# EAGLE design DIY Arduino - REV 1 (EAGLE 9.4.0)
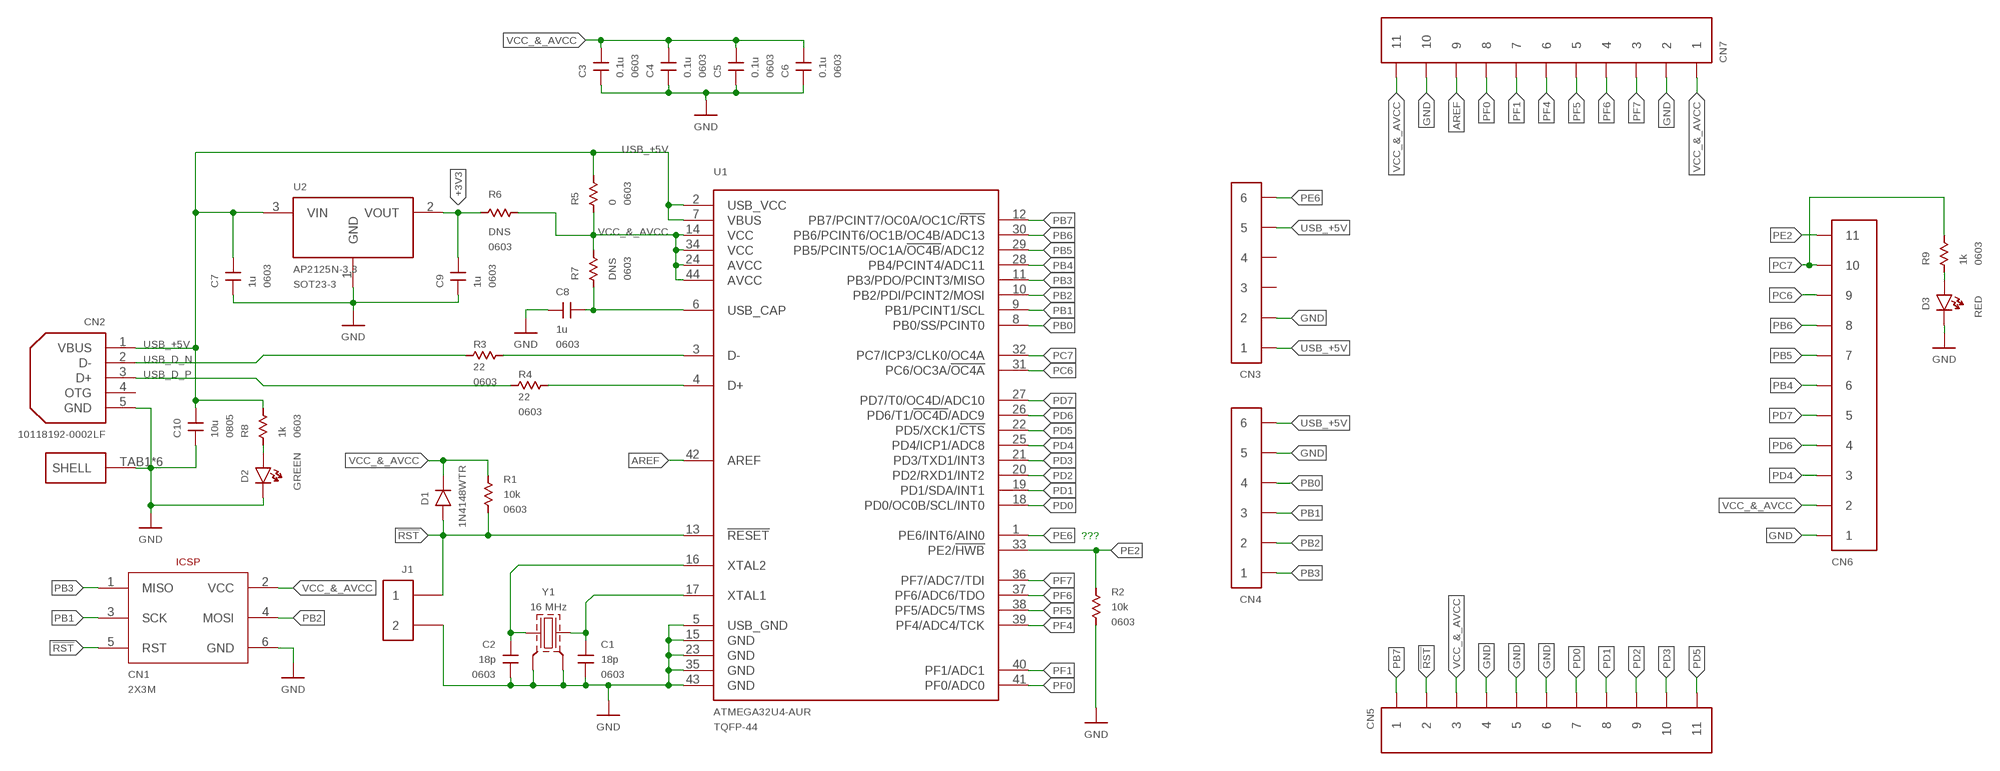
[diagram p0: schematic, sheet 1]

## Parts
C1  18p  C_SMDC0603  [EIA0603]
C2  18p  C_SMDC0603  [EIA0603]
C3  0.1u  C_SMDC0603  [EIA0603]
C4  0.1u  C_SMDC0603  [EIA0603]
C5  0.1u  C_SMDC0603  [EIA0603]
C6  0.1u  C_SMDC0603  [EIA0603]
C7  1u  C_SMDC0603  [EIA0603]
C8  1u  C_SMDC0603  [EIA0603]
C9  1u  C_SMDC0603  [EIA0603]
C10  10u  C_SMDC0805  [EIA0805]
CN1  2X3M  2X3_ICSPARDUINO_ICSP  [2X3_100MIL_ICSP]
CN2  10118192-0002LF  USB_MICRO_B_GENERICSMT  [AMPHENOL_10118192-0002LF]
CN3  1X6THRU  [1X6_100MIL_THRU]
CN4  1X6THRU  [1X6_100MIL_THRU]
CN5  1X11  [1X11_100MIL_THRU]
CN6  1X11  [1X11_100MIL_THRU]
CN7  1X11  [1X11_100MIL_THRU]
D1  1N4148WTR  SILICON  [SOD-123]
D2  GREEN  LED_SMD  [EIA0603_LED]
D3  RED  LED_SMD  [EIA0603_LED]
J1  1X2  [1X2_100MIL_THRU]
R1  10k  R_SMDR0603  [EIA0603]
R2  10k  R_SMDR0603  [EIA0603]
R3  22  R_SMDR0603  [EIA0603]
R4  22  R_SMDR0603  [EIA0603]
R5  0  R_SMDR0603  [EIA0603]
R6  DNS  R_SMDR0603  [EIA0603]
R7  DNS  R_SMDR0603  [EIA0603]
R8  1k  R_SMDR0603  [EIA0603]
R9  1k  R_SMDR0603  [EIA0603]
U1  ATMEGA32U4-AUR  ATMEGA32U4TQFP-44  [TQFP-44]
U2  AP2125N-3.3  AP2125FIXED  [SOT23-3]
Y1  16 MHz  CRYSTALFA-238  [EPSON_FA-238]

## Nets
!RST: CN1.5(RST) CN5.2 D1.A J1.1 R1.P$1 U1.13(!RESET)
+3V3: C9.P$2 R6.P$1 U2.2(VOUT)
AREF: CN7.9 U1.42(AREF)
D_N [USB_DIFF]: R3.P$2 U1.3(D-)
D_P [USB_DIFF]: R4.P$2 U1.4(D+)
GND: C1.P$1 C2.P$1 C3.P$1 C4.P$1 C5.P$1 C6.P$1 C7.P$1 C8.P$1 C9.P$1 C10.P$1 CN1.6(GND) CN2.5(GND) CN2.TAB1(SHELL) CN2.TAB2(SHELL) CN2.TAB3(SHELL) CN2.TAB4(SHELL) CN2.TAB5(SHELL) CN2.TAB6(SHELL) CN3.2 CN4.5 CN5.4 CN5.5 CN5.6 CN6.1 CN7.2 CN7.10 D2.C D3.C J1.2 R2.P$1 U1.5(USB_GND) U1.15(GND) U1.23(GND) U1.35(GND) U1.43(GND) U2.1(GND) Y1.2(GND) Y1.4(GND)
N$1: C2.P$2 U1.16(XTAL2) Y1.1
N$2: D3.A R9.P$1
N$3: C8.P$2 R7.P$1 U1.6(USB_CAP)
N$4: C1.P$2 U1.17(XTAL1) Y1.3
N$7: D2.A R8.P$1
PB0: CN4.4 U1.8(PB0/SS/PCINT0)
PB1: CN1.3(SCK) CN4.3 U1.9(PB1/PCINT1/SCL)
PB2: CN1.4(MOSI) CN4.2 U1.10(PB2/PDI/PCINT2/MOSI)
PB3: CN1.1(MISO) CN4.1 U1.11(PB3/PDO/PCINT3/MISO)
PB4: CN6.6 U1.28(PB4/PCINT4/ADC11)
PB5: CN6.7 U1.29(PB5/PCINT5/OC1A/!OC4B!/ADC12)
PB6: CN6.8 U1.30(PB6/PCINT6/OC1B/OC4B/ADC13)
PB7: CN5.1 U1.12(PB7/PCINT7/OC0A/OC1C/!RTS)
PC6: CN6.9 U1.31(PC6/OC3A/!OC4A)
PC7: CN6.10 R9.P$2 U1.32(PC7/ICP3/CLK0/OC4A)
PD0: CN5.7 U1.18(PD0/OC0B/SCL/INT0)
PD1: CN5.8 U1.19(PD1/SDA/INT1)
PD2: CN5.9 U1.20(PD2/RXD1/INT2)
PD3: CN5.10 U1.21(PD3/TXD1/INT3)
PD4: CN6.3 U1.25(PD4/ICP1/ADC8)
PD5: CN5.11 U1.22(PD5/XCK1/!CTS)
PD6: CN6.4 U1.26(PD6/T1/!OC4D!/ADC9)
PD7: CN6.5 U1.27(PD7/T0/OC4D/ADC10)
PE2: CN6.11 R2.P$2 U1.33(PE2/!HWB)
PE6: CN3.6 U1.1(PE6/INT6/AIN0)
PF0: CN7.8 U1.41(PF0/ADC0)
PF1: CN7.7 U1.40(PF1/ADC1)
PF4: CN7.6 U1.39(PF4/ADC4/TCK)
PF5: CN7.5 U1.38(PF5/ADC5/TMS)
PF6: CN7.4 U1.37(PF6/ADC6/TDO)
PF7: CN7.3 U1.36(PF7/ADC7/TDI)
USB_+5V: C7.P$2 C10.P$2 CN2.1(VBUS) CN3.1 CN3.5 CN4.6 R5.P$2 R8.P$2 U1.2(USB_VCC) U1.7(VBUS) U2.3(VIN)
USB_D_N [USB_DIFF]: CN2.2(D-) R3.P$1
USB_D_P [USB_DIFF]: CN2.3(D+) R4.P$1
VCC_&_AVCC: C3.P$2 C4.P$2 C5.P$2 C6.P$2 CN1.2(VCC) CN5.3 CN6.2 CN7.1 CN7.11 D1.C R1.P$2 R5.P$1 R6.P$2 R7.P$2 U1.14(VCC) U1.24(AVCC) U1.34(VCC) U1.44(AVCC)
Unconnected: CN2.4(OTG) CN3.3 CN3.4

## Notes on the sheet
- ???

## Library data of the parts
C1 C2 = USER_SMT_CHIP_STANDARD:C_SMD; MPN: C0603C180J5GACTU; PACKAGE: 0603
C3-C6 = USER_SMT_CHIP_STANDARD:C_SMD; MPN: CL10B104KB8NNNC; PACKAGE: 0603
C7-C9 = USER_SMT_CHIP_STANDARD:C_SMD; MPN: CL10B105KP8NNNC; PACKAGE: 0603
C10 = USER_SMT_CHIP_STANDARD:C_SMD; MPN: CL21A106KOFNNNE; PACKAGE: 0805
CN1 = USER_CON_PINS:2X3_ICSP; MPN: PH2-06-UA
CN2 = USER_CONN_USB:USB_MICRO_B_GENERIC; MPN: 10118192-0002LF
CN3 CN4 = USER_CON_PINS:1X6
CN5-CN7 = USER_CON_PINS:1X11
D1 = USER_DIODES:SILICON; MPN: 1N4148WTR
D2 = USER_SMT_CHIP_STANDARD:LED_SMD; MPN: HSME-C191
D3 = USER_SMT_CHIP_STANDARD:LED_SMD; MPN: ASMT-RR45-AQ902
J1 = USER_CON_PINS:1X2
R1 R2 = USER_SMT_CHIP_STANDARD:R_SMD; MPN: ERJ-3EKF1002V; PACKAGE: 0603
R3 R4 = USER_SMT_CHIP_STANDARD:R_SMD; MPN: ERJ-3EKF22R0V; PACKAGE: 0603
R5 = USER_SMT_CHIP_STANDARD:R_SMD; MPN: RMCF0603ZT0R00; PACKAGE: 0603
R6 R7 = USER_SMT_CHIP_STANDARD:R_SMD; PACKAGE: 0603
R8 R9 = USER_SMT_CHIP_STANDARD:R_SMD; MPN: ERJ-3EKF1001V; PACKAGE: 0603
U1 = USER_AVR_MICROCONTROLLERS:ATMEGA32U4; MPN: ATMEGA32U4-AUR; PACKAGE: TQFP-44
U2 = USER_PMIC:AP2125; MPN: AP2125N-3.3TRG1; PACKAGE: SOT23-3
Y1 = USER_CRYSTALS:CRYSTAL; MPN: FA-238 16.0000MB-C3

## Net classes
1 USB_DIFF: width 0.254 mm, clearance 0.178 mm

## Board
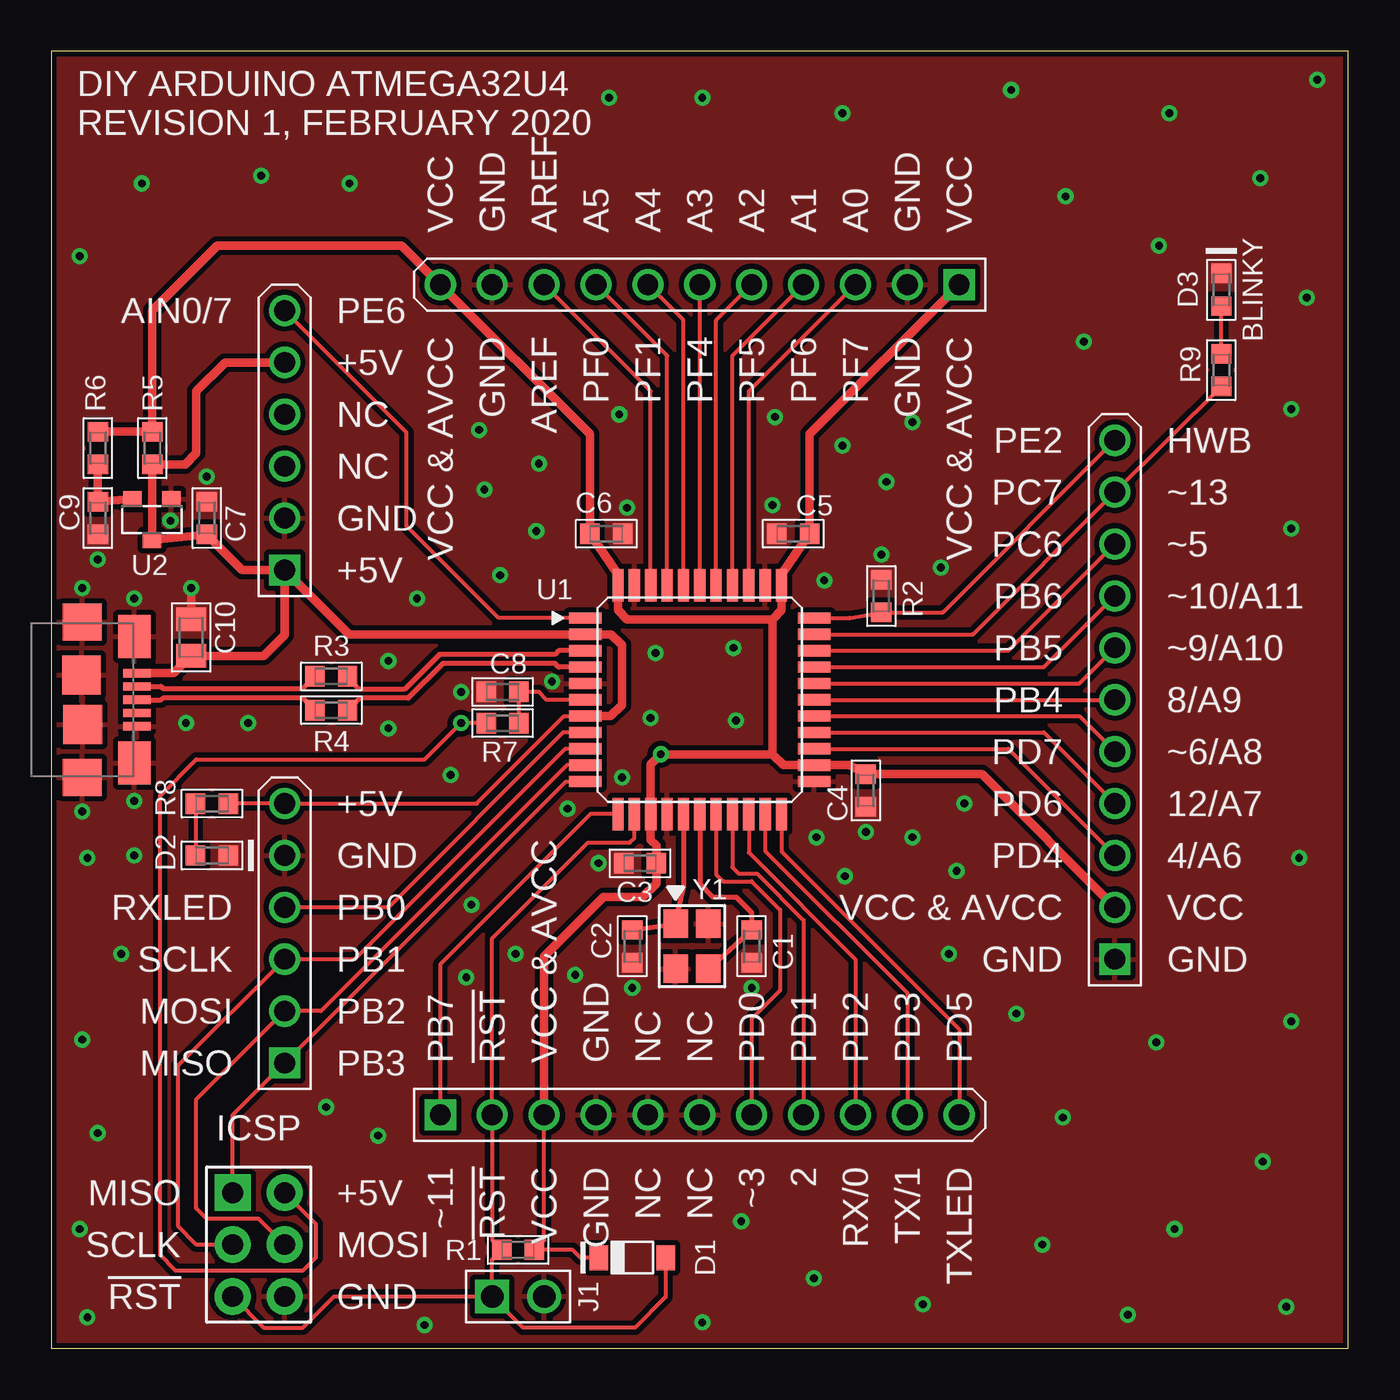
[diagram p1: board, top side]
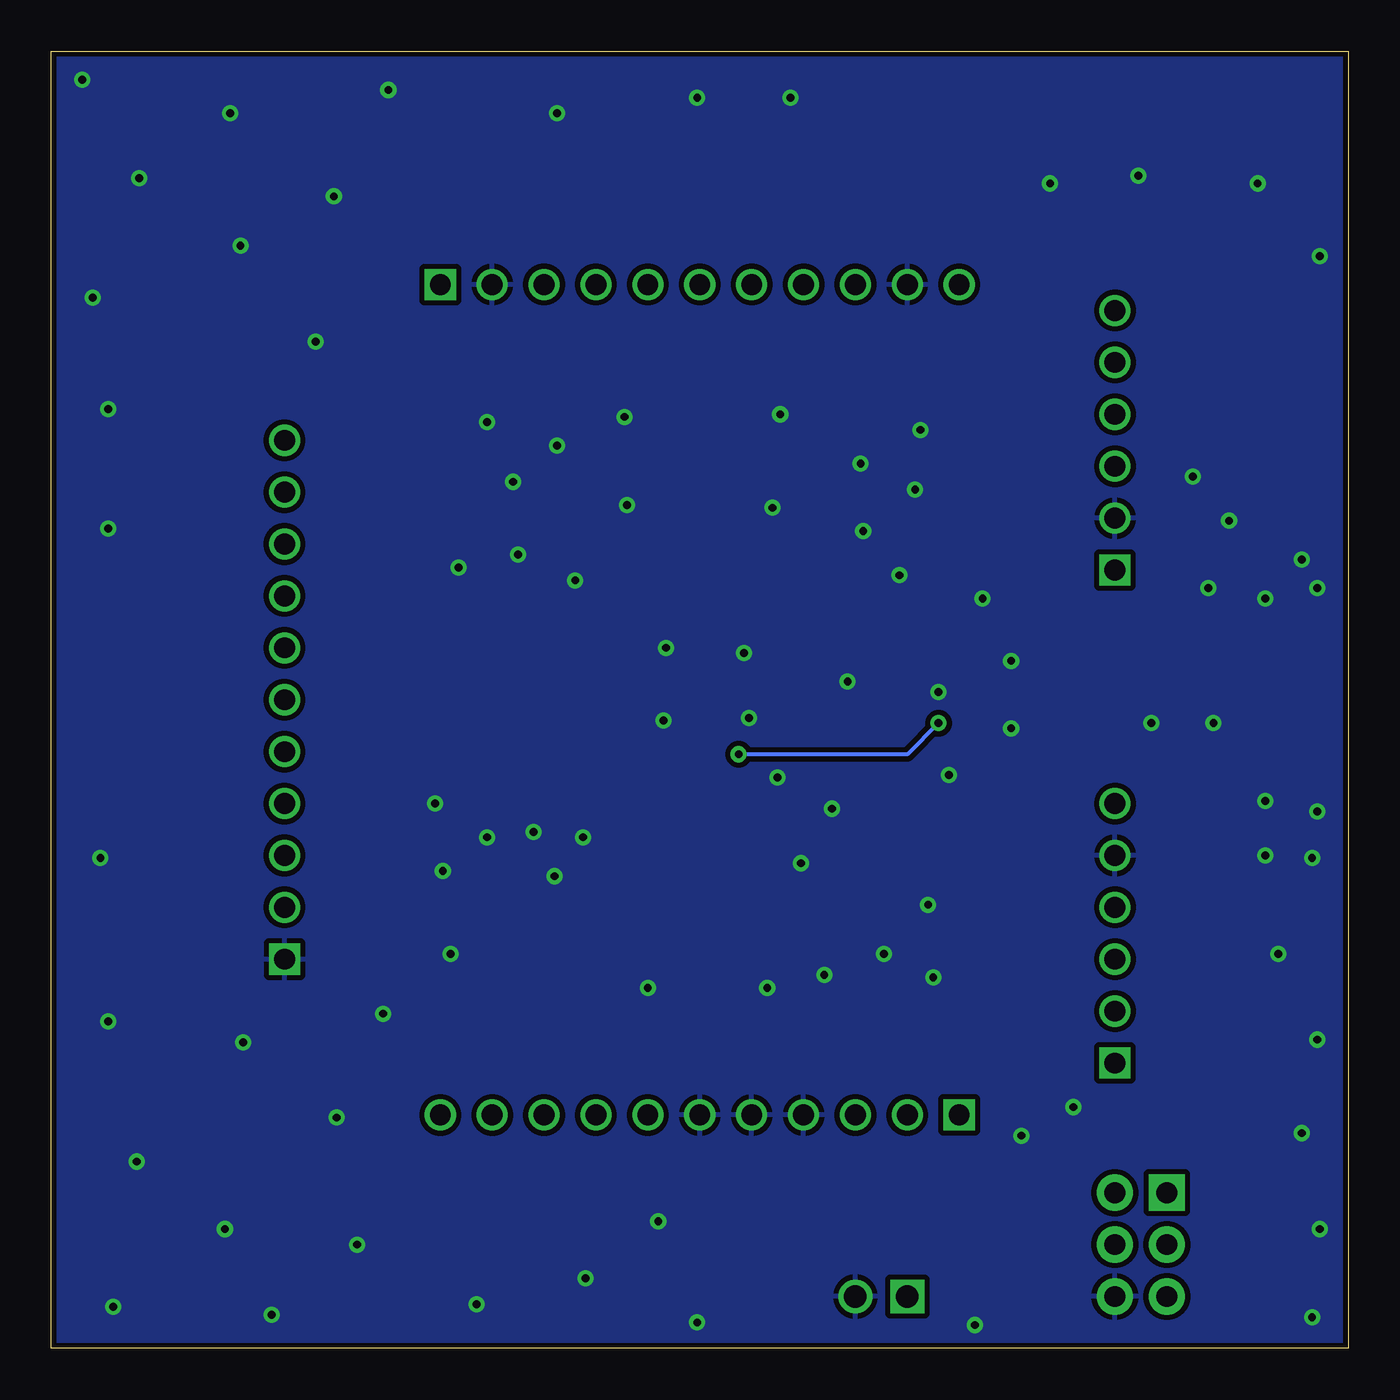
[diagram p2: board, bottom side, seen from below]

Size 63.5 x 63.5 mm. Coordinates in mm from the lower left corner, seen from the top.
Outline: 0,0 63.5,0 63.5,63.5 0,63.5 0,0
Copper layers (1*16): Top 0.035mm / dielectric 60mil / Bottom 0.035559375mm
Design rules "default *": minimum track width 6mil, minimum drill 15mil, track to track 6mil, track to pad 6mil, pad to pad 6mil, via to via 6mil, smd to smd 0mil, copper to edge 10mil, drill to drill 6mil, minimum pad ring 10mil, minimum via ring 8mil, stop-mask expansion 4mil, vias tented up to drill 0mil, thermal gap 10mil

### Footprints (pad centres in the part's own frame; a part is rotated, then mirrored left to right if it is on the bottom)
EIA0603 = smd 0.95 x 1: P$1 -0.8,0; P$2 0.8,0
EIA0805 = smd 1.15 x 1.45: P$1 -0.9,0; P$2 0.9,0
2X3_100MIL_ICSP = drill 1.016 pad 1.778 square: 1 -1.27,2.54 | drill 1.016 pad 1.778: 2 1.27,2.54; 3 -1.27,0; 4 1.27,0; 5 -1.27,-2.54; 6 1.27,-2.54
AMPHENOL_10118192-0002LF = smd 0.4 x 1.35: 1 -1.3,2.675; 2 -0.65,2.675; 3 0,2.675; 4 0.65,2.675; 5 1.3,2.675 | smd 2.1 x 1.6: TAB1 -3.1,2.55; TAB2 3.1,2.55 | smd 1.8 x 1.9: TAB3 3.8,0; TAB6 -3.8,0 | smd 1.9 x 1.9: TAB4 1.204,0.029; TAB5 -1.21,-0.035
1X6_100MIL_THRU = drill 1.016 square: 1 0,6.35 | drill 1.016: 2 0,3.81; 3 0,1.27; 4 0,-1.27; 5 0,-3.81; 6 0,-6.35
1X11_100MIL_THRU = drill 1.016 square: 1 0,12.7 | drill 1.016: 2 0,10.16; 3 0,7.62; 4 0,5.08; 5 0,2.54; 6 0,0; 7 0,-2.54; 8 0,-5.08; 9 0,-7.62; 10 0,-10.16; 11 0,-12.7
SOD-123 = smd 0.914 x 1.219: A -1.638,0; C 1.638,0
EIA0603_LED = smd 0.95 x 1: A -0.8,0; C 0.8,0
1X2_100MIL_THRU = drill 1.1 square: 1 0,1.27 | drill 1.1: 2 0,-1.27
TQFP-44 = smd 1.6 x 0.55: 1 -5.6,4; 2 -5.6,3.2; 3 -5.6,2.4; 4 -5.6,1.6; 5 -5.6,0.8; 6 -5.6,0; 7 -5.6,-0.8; 8 -5.6,-1.6; 9 -5.6,-2.4; 10 -5.6,-3.2; 11 -5.6,-4; 23 5.6,-4; 24 5.6,-3.2; 25 5.6,-2.4; 26 5.6,-1.6; 27 5.6,-0.8; 28 5.6,0; 29 5.6,0.8; 30 5.6,1.6; 31 5.6,2.4; 32 5.6,3.2; 33 5.6,4 | smd 0.55 x 1.6: 12 -4,-5.6; 13 -3.2,-5.6; 14 -2.4,-5.6; 15 -1.6,-5.6; 16 -0.8,-5.6; 17 0,-5.6; 18 0.8,-5.6; 19 1.6,-5.6; 20 2.4,-5.6; 21 3.2,-5.6; 22 4,-5.6; 34 4,5.6; 35 3.2,5.6; 36 2.4,5.6; 37 1.6,5.6; 38 0.8,5.6; 39 0,5.6; 40 -0.8,5.6; 41 -1.6,5.6; 42 -2.4,5.6; 43 -3.2,5.6; 44 -4,5.6
SOT23-3 = smd 0.9 x 0.8: 1 -0.95,-1; 2 0.95,-1; 3 0,1
EPSON_FA-238 = smd 1.4 x 1.2: 1 -1.1,-0.8; 2 1.1,-0.8; 3 1.1,0.8; 4 -1.1,0.8

### Placement (x,y rotation side)
C1  34.29,19.68 90 top
C2  28.45,19.68 90 top
C3  28.83,23.75 0 top
C4  39.88,27.3 90 top
C5  36.32,39.88 0 top
C6  27.18,39.88 180 top
C7  7.62,40.64 270 top
C8  22.1,32.13 0 top
C9  2.29,40.64 90 top
C10  6.86,34.8 270 top
CN1  10.16,5.08 0 top
CN2  1.52,31.75 270 top
CN3  11.43,44.45 180 top
CN4  11.43,20.32 180 top
CN5  31.75,11.43 90 top
CN6  52.07,31.75 180 top
CN7  31.75,52.07 270 top
D1  28.45,4.45 180 top
D2  7.87,24.13 0 top
D3  57.28,51.82 90 top
J1  22.86,2.54 90 top
R1  22.86,4.83 0 top
R2  40.64,36.83 270 top
R3  13.72,32.89 0 top
R4  13.72,31.24 0 top
R5  4.95,44.07 270 top
R6  2.29,44.07 90 top
R7  22.1,30.61 180 top
R8  7.87,26.67 0 top
R9  57.28,47.88 270 top
U1  31.75,31.75 0 top
U2  4.94,40.57 180 top
Y1  31.37,19.68 270 top

### Tracks (layer width: path | path; a pad name or v marks a point on that pad's centre or on a via)
!RST
  Top 0.203: U1.13 28.55,24.99 28.32,24.77 26.29,24.77 21.59,20.07 CN5.2 21.59,5.3 R1.P$1 21.59,4.36 J1.1 | J1.1 13.84,2.54 12.32,1.02 10.41,1.02 CN1.5 | D1.A 30.09,2.53 28.57,1.02 23.11,1.02 J1.1
+3V3
  Top 0.406: U2.2 C9.P$2 R6.P$1
AREF
  Top 0.203: U1.42 29.35,46.85 CN7.9
D_N
  Top 0.254: U1.3 24.84,34.15 24.66,33.97 19,33.97 17.3,32.26 15.11,32.26 14.52,32.85 R3.P$2
D_P
  Top 0.254: U1.4 24.84,33.35 24.66,33.53 19.18,33.53 17.48,31.83 15.11,31.83 R4.P$2
GND  (via drill 0.38)
  Top 0.406: C10.P$1 v6.86,37.21
  other vias: 34.29,17.65 28.45,17.65 2.29,38.61 7.62,42.67 24.51,32.64 16.51,33.66 20.07,32.13 1.52,26.29 4.06,26.8 1.52,37.21 4.06,36.7 5.84,40.51 28.19,41.15 35.31,41.27 40.64,38.86 39.88,25.27 26.8,23.75 13.46,11.81 16,10.41 33.78,6.22 37.34,3.43 42.67,2.16 31.88,1.27 18.29,1.14 1.78,1.52 1.4,5.84 2.29,10.54 1.52,15.11 3.43,19.3 1.78,24 4.06,24.13 16.51,30.35 19.56,28.07 6.6,30.61 9.65,30.61 17.91,36.7 20.95,44.96 23.88,43.31 21.21,42.04 23.75,40.01 21.97,37.85 27.81,45.72 35.43,45.59 38.73,44.2 42.16,45.34 40.89,42.42 43.56,38.23 37.85,37.59 29.59,34.04 33.4,34.29 33.53,30.73 29.34,30.86 27.94,27.94 25.27,26.42 20.57,21.72 20.32,18.16 22.73,19.3 25.65,18.29 37.47,25.02 38.86,23.11 44.32,23.37 44.7,26.67 42.16,25.02 43.94,19.3 47.24,16.38 54.1,14.99 49.53,11.3 48.51,5.08 52.7,1.65 60.45,2.03 54.99,5.84 59.31,9.14 60.71,16 61.09,24 60.71,40.13 60.71,45.97 61.47,51.44 50.55,49.28 49.66,56.39 54.23,53.98 59.18,57.28 61.98,62.1 54.74,60.45 46.99,61.59 38.73,60.45 31.88,61.21 27.3,61.21 14.61,57.02 10.29,57.4 4.45,57.02 1.4,53.47
  pour Top (isolate 0.254): 0,63.5 0,0 63.5,0 63.5,63.5
  pour Bottom (isolate 0.254): 0,63.5 0,0 63.5,0 63.5,63.5
N$1
  Top 0.254: C2.P$2 30.5,20.78 | 30.5,20.78 Y1.1 | U1.16 30.95,22.62 30.5,20.78
N$2
  Top 0.203: R9.P$1 D3.A
N$3
  Top 0.203: R7.P$1 C8.P$2 23.88,32.13 24.26,31.75 U1.6
N$4
  Top 0.254: U1.17 31.75,22.73 32.38,22.1 33.53,22.1 34.29,21.34 C1.P$2 Y1.3
N$7
  Top 0.203: R8.P$1 D2.A
PB0
  Top 0.203: U1.8 25.07,30.15 16.51,21.59 CN4.4
PB1
  Top 0.203: U1.9 25.16,29.35 14.86,19.05 CN4.3 6.22,13.84 6.22,5.97 7.11,5.08 CN1.3
PB2
  Top 0.203: U1.10 25.25,28.55 13.21,16.51 CN4.2 7.11,12.19 7.11,6.86 7.62,6.35 10.16,6.35 CN1.4
PB3
  Top 0.203: U1.11 25.21,27.75 CN4.1 8.89,11.43 CN1.1
PB4
  Top 0.203: U1.28 CN6.6
PB5
  Top 0.203: U1.29 50.33,32.55 CN6.7
PB6
  Top 0.203: U1.30 48.59,33.35 CN6.8
PB7
  Top 0.203: U1.12 26.4,26.15 19.05,18.8 CN5.1
PC6
  Top 0.203: U1.31 46.85,34.15 CN6.9
PC7
  Top 0.203: U1.32 45.11,34.95 CN6.10 R9.P$2
PD0
  Top 0.203: U1.18 32.55,23.2 32.89,22.86 34.29,22.86 35.69,21.46 35.69,17.53 34.29,16.13 CN5.7
PD1
  Top 0.203: U1.19 33.35,23.55 33.66,23.24 34.54,23.24 36.83,20.95 CN5.8
PD2
  Top 0.203: U1.20 34.15,24.27 39.37,19.05 CN5.9
PD3
  Top 0.203: U1.21 34.95,24.36 41.91,17.4 CN5.10
PD4
  Top 0.203: U1.25 46.85,29.35 CN6.3
PD5
  Top 0.203: U1.22 35.75,24.32 44.45,15.62 CN5.11
PD6
  Top 0.203: U1.26 48.59,30.15 CN6.4
PD7
  Top 0.203: U1.27 50.33,30.95 CN6.5
PE2
  Top 0.203: U1.33 39.09,35.75 R2.P$2 43.65,36.03 CN6.11
PE6
  Top 0.203: U1.1 21.91,35.75 17.4,40.26 17.4,44.83 CN3.6
PF0
  Top 0.203: U1.41 30.15,48.59 CN7.8
PF1
  Top 0.203: U1.40 30.95,50.33 CN7.7
PF4
  Top 0.203: U1.39 CN7.6
PF5
  Top 0.203: U1.38 32.55,50.33 CN7.5
PF6
  Top 0.203: U1.37 33.35,48.59 CN7.4
PF7
  Top 0.203: U1.36 34.15,46.85 CN7.3
USB_+5V
  Top 0.203: U1.7 25.11,30.95 20.83,26.67 CN4.6 R8.P$2
  Top 0.406: CN2.1 6.01,33.05 C10.P$2 10.4,33.9 11.43,34.92 CN3.1 | CN3.1 14.58,34.95 U1.2 27.41,34.95 27.94,34.42 27.94,31.5 27.39,30.95 U1.7 | CN3.1 9.36,38.1 C7.P$2 U2.3 R5.P$2 6.57,43.27 7.11,43.81 7.11,46.86 8.51,48.26 CN3.5
USB_D_N
  Top 0.254: CN2.2 5.38,32.4 5.49,32.29 12.32,32.29 R3.P$1
USB_D_P
  Top 0.254: CN2.3 5.38,31.75 5.49,31.86 12.32,31.86 12.92,31.26 R4.P$1
VCC_&_AVCC  (via drill 0.38)
  Top 0.203: CN5.3 24.13,5.3 R1.P$2 25.53,4.83 25.91,4.45 D1.C | R7.P$2 v20.07,30.61 18.29,28.83 7.11,28.83 5.33,27.05 5.33,4.57 6.1,3.81 12.32,3.81 12.95,4.45 12.95,6.1 CN1.2
  Top 0.406: CN5.3 24.13,19.18 27.05,22.1 28.96,22.1 29.63,22.77 C3.P$2 29.63,24.61 29.35,24.89 U1.14 29.35,28.57 v29.84,29.07 | CN7.1 37.12,44.74 C5.P$2 35.75,37.87 U1.34 35.75,36.13 35.31,35.69 | CN6.2 45.55,28.11 C4.P$2 39.05,28.55 U1.24 35.84,28.55 35.31,29.08 | R6.P$2 R5.P$1 4.95,50.8 8.13,53.98 17.14,53.98 CN7.11 26.38,44.74 C6.P$2 27.75,37.87 U1.44 27.75,36.13 28.19,35.69 35.31,35.69 | 35.31,35.69 35.31,29.08 | v29.84,29.07 v29.84,29.08 | 35.31,29.08 29.86,29.08 v29.84,29.07
  Bottom 0.203: v20.07,30.61 21.59,29.08 v29.84,29.08

### Text on the board
tPlace: DIY ARDUINO ATMEGA32U4 / REVISION 1, FEBRUARY 2020 | VCC | GND | AREF | A5 | A4 | A3 | A2 | A1 | A0 | GND | VCC | BLINKY | AIN0/7 | PE6 | VCC & AVCC | GND | AREF | PF0 | PF1 | PF4 | PF5 | PF6 | PF7 | GND | VCC & AVCC | +5V | NC | PE2 | HWB | NC | PC7 | ~13 | GND | PC6 | ~5 | +5V | PB6 | ~10/A11 | PB5 | ~9/A10 | PB4 | 8/A9 | PD7 | ~6/A8 | +5V | PD6 | 12/A7 | GND | PD4 | 4/A6 | RXLED | PB0 | VCC & AVCC | VCC | SCLK | PB1 | GND | GND | MOSI | PB2 | MISO | PB3 | PB7 | !RST | VCC & AVCC | GND | NC | NC | PD0 | PD1 | PD2 | PD3 | PD5 | ~11 | !RST | VCC | GND | NC | NC | ~3 | 2 | RX/0 | TX/1 | TXLED | MISO | +5V | SCLK | MOSI | !RST | GND